# EAGLE design Battery Discharge Monitoring Board rev2 (EAGLE 9.3.0)
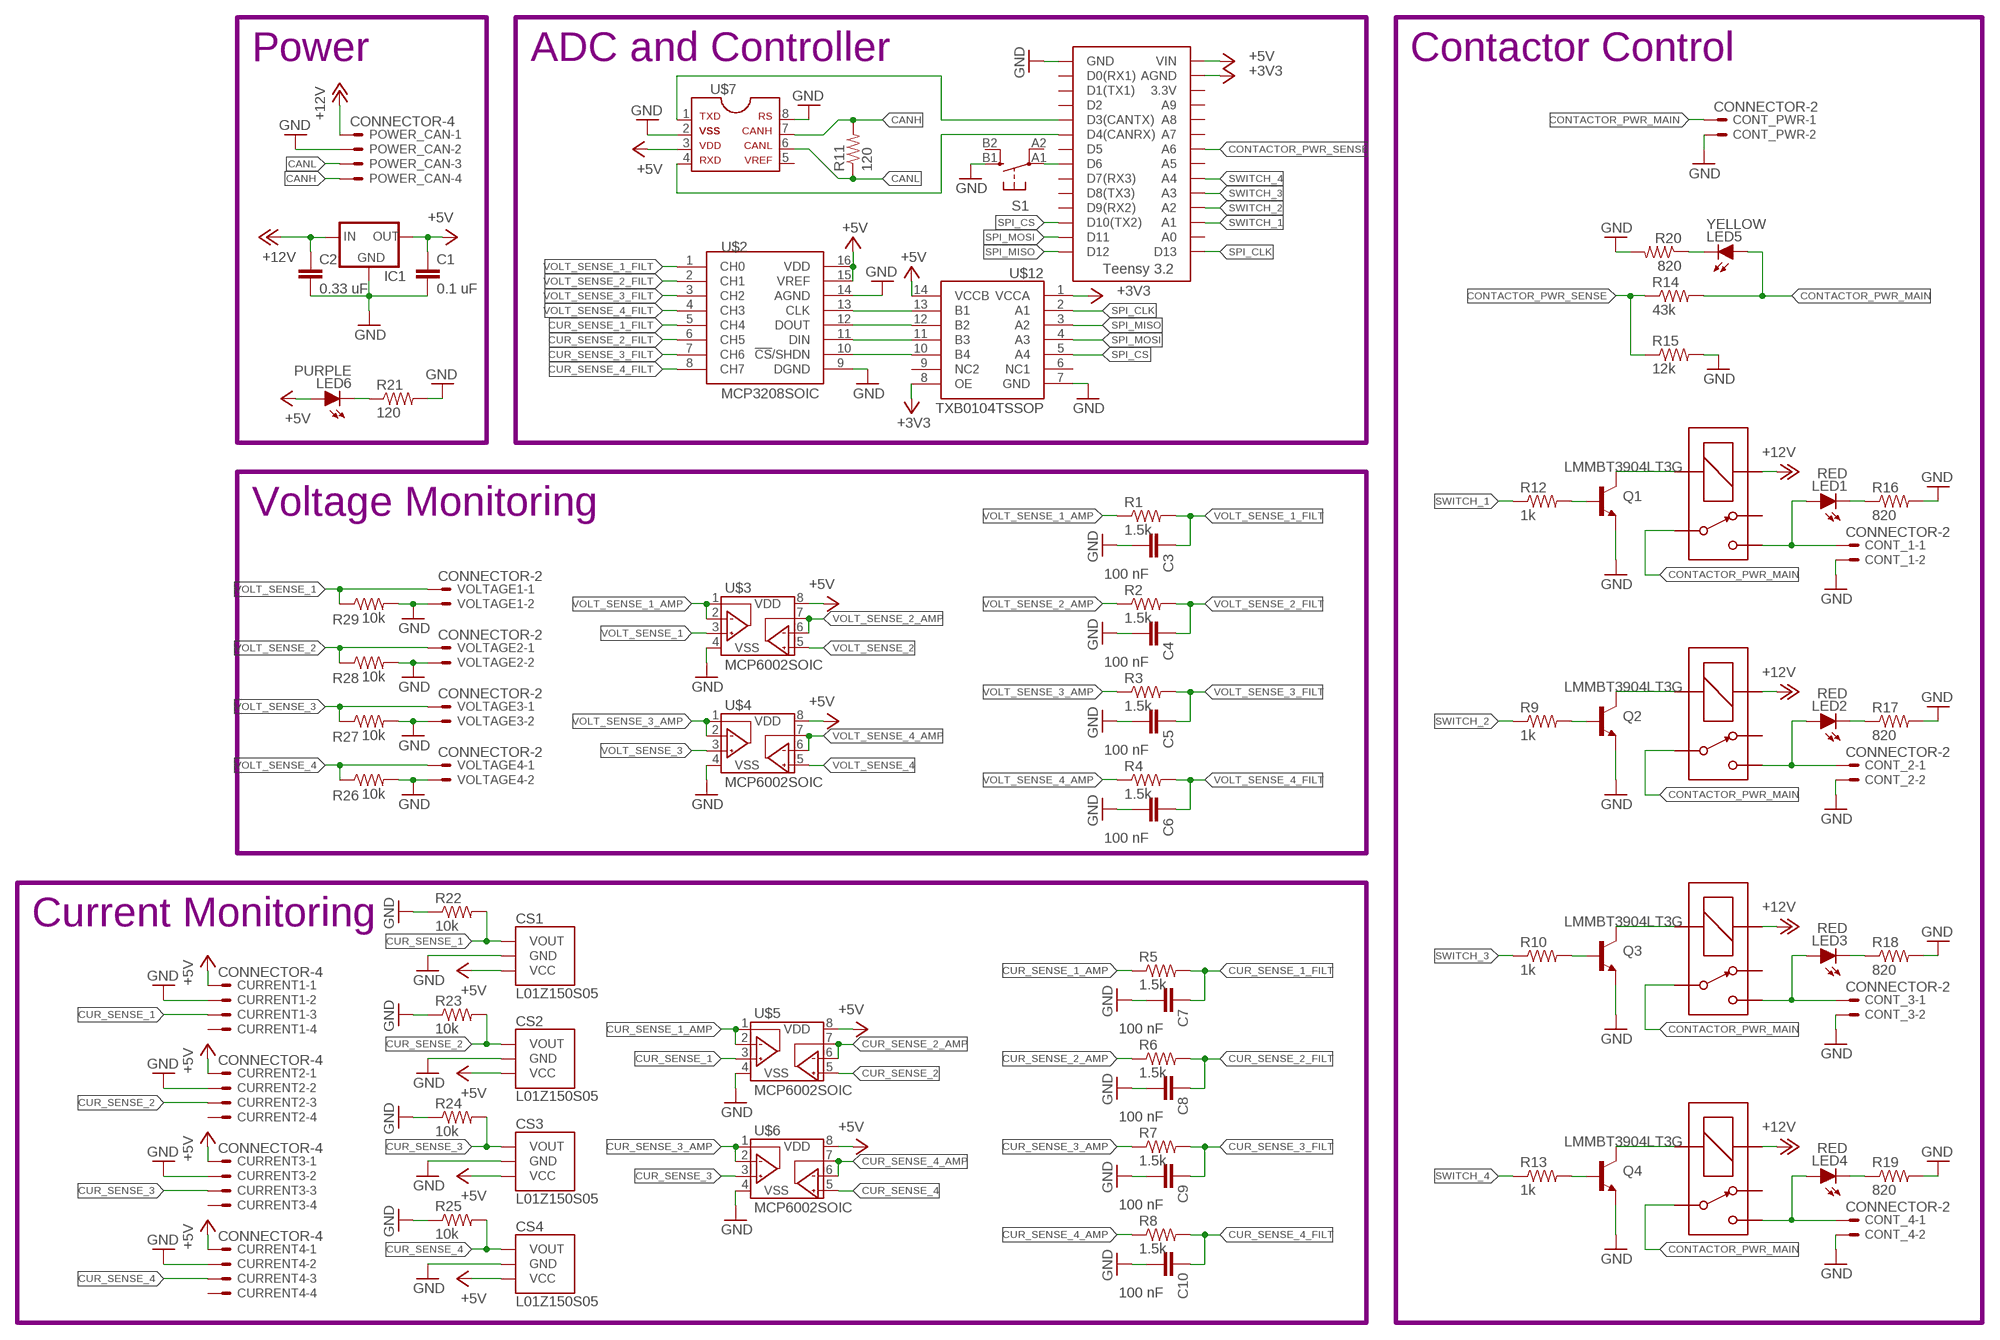
[diagram p0: schematic, sheet 1]

## Parts
C1  0.1 uF  CAP0805  [0805]
C2  0.33 uF  CAP0805  [0805]
C3  100 nF  CAP0805  [0805]
C4  100 nF  CAP0805  [0805]
C5  100 nF  CAP0805  [0805]
C6  100 nF  CAP0805  [0805]
C7  100 nF  CAP0805  [0805]
C8  100 nF  CAP0805  [0805]
C9  100 nF  CAP0805  [0805]
C10  100 nF  CAP0805  [0805]
CONT_1  CONNECTOR-2  [MINIFIT_5566-2]
CONT_2  CONNECTOR-2  [MINIFIT_5566-2]
CONT_3  CONNECTOR-2  [MINIFIT_5566-2]
CONT_4  CONNECTOR-2  [MINIFIT_5566-2]
CONT_PWR  CONNECTOR-2  [MINIFIT_5566-2]
CS1  L01Z150S05  [L01Z150S05]
CS2  L01Z150S05  [L01Z150S05]
CS3  L01Z150S05  [L01Z150S05]
CS4  L01Z150S05  [L01Z150S05]
CURRENT1  CONNECTOR-4  [MINIFIT_5566-4]
CURRENT2  CONNECTOR-4  [MINIFIT_5566-4]
CURRENT3  CONNECTOR-4  [MINIFIT_5566-4]
CURRENT4  CONNECTOR-4  [MINIFIT_5566-4]
IC1  5VREG_L7805SPACED  [TO-220-SPACED]
LED1  RED  LED-0805  [LED-805]
LED2  RED  LED-0805  [LED-805]
LED3  RED  LED-0805  [LED-805]
LED4  RED  LED-0805  [LED-805]
LED5  YELLOW  LED-0805  [LED-805]
LED6  PURPLE  LED-0805  [LED-805]
POWER_CAN  CONNECTOR-4  [MINIFIT_5566-4]
Q1  LMMBT3904LT3G  BJT_NPNSOT  [SOT23]
Q2  LMMBT3904LT3G  BJT_NPNSOT  [SOT23]
Q3  LMMBT3904LT3G  BJT_NPNSOT  [SOT23]
Q4  LMMBT3904LT3G  BJT_NPNSOT  [SOT23]
R1  1.5k  RESISTOR0805-RES  [0805]
R2  1.5k  RESISTOR0805-RES  [0805]
R3  1.5k  RESISTOR0805-RES  [0805]
R4  1.5k  RESISTOR0805-RES  [0805]
R5  1.5k  RESISTOR0805-RES  [0805]
R6  1.5k  RESISTOR0805-RES  [0805]
R7  1.5k  RESISTOR0805-RES  [0805]
R8  1.5k  RESISTOR0805-RES  [0805]
R9  1k  RESISTOR0805-RES  [0805]
R10  1k  RESISTOR0805-RES  [0805]
R11  120  RESISTOR0805-RES  [0805]
R12  1k  RESISTOR0805-RES  [0805]
R13  1k  RESISTOR0805-RES  [0805]
R14  43k  RESISTOR0805-RES  [0805]
R15  12k  RESISTOR0805-RES  [0805]
R16  820  RESISTOR0805-RES  [0805]
R17  820  RESISTOR0805-RES  [0805]
R18  820  RESISTOR0805-RES  [0805]
R19  820  RESISTOR0805-RES  [0805]
R20  820  RESISTOR0805-RES  [0805]
R21  120  RESISTOR0805-RES  [0805]
R22  10k  RESISTOR0805-RES  [0805]
R23  10k  RESISTOR0805-RES  [0805]
R24  10k  RESISTOR0805-RES  [0805]
R25  10k  RESISTOR0805-RES  [0805]
R26  10k  RESISTOR0805-RES  [0805]
R27  10k  RESISTOR0805-RES  [0805]
R28  10k  RESISTOR0805-RES  [0805]
R29  10k  RESISTOR0805-RES  [0805]
S1  BTN_10-XXSMD  [TACTILE_SWITCH_SMD_6.2MM_TALL]
U$1  TEENSY_3.2_SIMPLE  [TEENSY_3.2_SIMPLE]
U$2  MCP3208SOIC  [SOIC-16]
U$3  MCP6002SOIC  [SOIC-08]
U$4  MCP6002SOIC  [SOIC-08]
U$5  MCP6002SOIC  [SOIC-08]
U$6  MCP6002SOIC  [SOIC-08]
U$7  MCP2551  [SOIC-08]
U$8  G5LE  [ZF112]
U$9  G5LE  [ZF112]
U$10  G5LE  [ZF112]
U$11  G5LE  [ZF112]
U$12  TXB0104TSSOP  [TSSOP-14]
VOLTAGE1  CONNECTOR-2  [MINIFIT_5566-2]
VOLTAGE2  CONNECTOR-2  [MINIFIT_5566-2]
VOLTAGE3  CONNECTOR-2  [MINIFIT_5566-2]
VOLTAGE4  CONNECTOR-2  [MINIFIT_5566-2]

## Nets
+3V3: U$1.AGND U$12.1(VCCA) U$12.8(OE)
+5V: C1.1 CS1.3(VCC) CS2.3(VCC) CS3.3(VCC) CS4.3(VCC) CURRENT1.1 CURRENT2.1 CURRENT3.1 CURRENT4.1 IC1.3(OUT) LED6.A U$1.VIN U$2.15(VREF) U$2.16(VDD) U$3.8(VDD) U$4.8(VDD) U$5.8(VDD) U$6.8(VDD) U$7.3 U$12.14(VCCB)
+12V: C2.1 IC1.1(IN) POWER_CAN.1 U$8.1(COIL+) U$9.1(COIL+) U$10.1(COIL+) U$11.1(COIL+)
CANH: POWER_CAN.4 R11.2 U$7.7
CANL: POWER_CAN.3 R11.1 U$7.6
CONTACTOR_PWR_1: CONT_1.1 LED1.A U$8.S
CONTACTOR_PWR_2: CONT_2.1 LED2.A U$9.S
CONTACTOR_PWR_3: CONT_3.1 LED3.A U$10.S
CONTACTOR_PWR_4: CONT_4.1 LED4.A U$11.S
CONTACTOR_PWR_MAIN: CONT_PWR.1 LED5.A R14.2 U$8.P U$9.P U$10.P U$11.P
CONTACTOR_PWR_SENSE: R14.1 R15.1 U$1.A6
CUR_SENSE_1: CS1.1(VOUT) CURRENT1.3 R22.2 U$5.3(VINA+)
CUR_SENSE_1_AMP: R5.1 U$5.1(VOUTA) U$5.2(VINA-)
CUR_SENSE_1_FILT: C7.1 R5.2 U$2.5(CH4)
CUR_SENSE_2: CS2.1(VOUT) CURRENT2.3 R23.2 U$5.5(VINB+)
CUR_SENSE_2_AMP: R6.1 U$5.6(VINB-) U$5.7(VOUTB)
CUR_SENSE_2_FILT: C8.1 R6.2 U$2.6(CH5)
CUR_SENSE_3: CS3.1(VOUT) CURRENT3.3 R24.2 U$6.3(VINA+)
CUR_SENSE_3_AMP: R7.1 U$6.1(VOUTA) U$6.2(VINA-)
CUR_SENSE_3_FILT: C9.1 R7.2 U$2.7(CH6)
CUR_SENSE_4: CS4.1(VOUT) CURRENT4.3 R25.2 U$6.5(VINB+)
CUR_SENSE_4_AMP: R8.1 U$6.6(VINB-) U$6.7(VOUTB)
CUR_SENSE_4_FILT: C10.1 R8.2 U$2.8(CH7)
GND: C1.2 C2.2 C3.2 C4.2 C5.2 C6.2 C7.2 C8.2 C9.2 C10.2 CONT_1.2 CONT_2.2 CONT_3.2 CONT_4.2 CONT_PWR.2 CS1.2(GND) CS2.2(GND) CS3.2(GND) CS4.2(GND) CURRENT1.2 CURRENT2.2 CURRENT3.2 CURRENT4.2 IC1.2(GND) POWER_CAN.2 Q1.2(EMITTER) Q2.2(EMITTER) Q3.2(EMITTER) Q4.2(EMITTER) R15.2 R16.2 R17.2 R18.2 R19.2 R20.2 R21.2 R22.1 R23.1 R24.1 R25.1 R26.2 R27.2 R28.2 R29.2 S1.B1(S) U$1.GND U$2.9(DGND) U$2.14(AGND) U$3.4(VSS) U$4.4(VSS) U$5.4(VSS) U$6.4(VSS) U$7.2 U$7.8 U$12.7(GND) VOLTAGE1.2 VOLTAGE2.2 VOLTAGE3.2 VOLTAGE4.2
N$1: U$1.D3(CANTX) U$7.1
N$2: U$1.D4(CANRX) U$7.4
N$3: Q2.1(BASE) R9.2
N$4: Q1.1(BASE) R12.2
N$5: Q1.3(COLLECTOR) U$8.2(COIL-)
N$6: Q2.3(COLLECTOR) U$9.2(COIL-)
N$7: Q3.1(BASE) R10.2
N$8: Q3.3(COLLECTOR) U$10.2(COIL-)
N$9: Q4.1(BASE) R13.2
N$10: Q4.3(COLLECTOR) U$11.2(COIL-)
N$11: LED2.C R17.1
N$12: LED1.C R16.1
N$13: LED3.C R18.1
N$14: LED4.C R19.1
N$15: LED5.C R20.1
N$16: LED6.C R21.1
N$17: U$2.13(CLK) U$12.13(B1)
N$18: U$2.12(DOUT) U$12.12(B2)
N$19: U$2.11(DIN) U$12.11(B3)
N$20: U$2.10(!CS!/SHDN) U$12.10(B4)
N$21: S1.A1(P) U$1.D6
SPI_CLK: U$1.D13 U$12.2(A1)
SPI_CS: U$1.D10(TX2) U$12.5(A4)
SPI_MISO: U$1.D12 U$12.3(A2)
SPI_MOSI: U$1.D11 U$12.4(A3)
SWITCH_1: R12.1 U$1.A1
SWITCH_2: R9.1 U$1.A2
SWITCH_3: R10.1 U$1.A3
SWITCH_4: R13.1 U$1.A4
VOLT_SENSE_1: R29.1 U$3.3(VINA+) VOLTAGE1.1
VOLT_SENSE_1_AMP: R1.1 U$3.1(VOUTA) U$3.2(VINA-)
VOLT_SENSE_1_FILT: C3.1 R1.2 U$2.1(CH0)
VOLT_SENSE_2: R28.1 U$3.5(VINB+) VOLTAGE2.1
VOLT_SENSE_2_AMP: R2.1 U$3.6(VINB-) U$3.7(VOUTB)
VOLT_SENSE_2_FILT: C4.1 R2.2 U$2.2(CH1)
VOLT_SENSE_3: R27.1 U$4.3(VINA+) VOLTAGE3.1
VOLT_SENSE_3_AMP: R3.1 U$4.1(VOUTA) U$4.2(VINA-)
VOLT_SENSE_3_FILT: C5.1 R3.2 U$2.3(CH2)
VOLT_SENSE_4: R26.1 U$4.5(VINB+) VOLTAGE4.1
VOLT_SENSE_4_AMP: R4.1 U$4.6(VINB-) U$4.7(VOUTB)
VOLT_SENSE_4_FILT: C6.1 R4.2 U$2.4(CH3)
Unconnected: CURRENT1.4 CURRENT2.4 CURRENT3.4 CURRENT4.4 S1.A2(P1) S1.B2(S1) U$1.3.3V U$1.A0 U$1.A5 U$1.A7 U$1.A8 U$1.A9 U$1.D0(RX1) U$1.D1(TX1) U$1.D2 U$1.D5 U$1.D7(RX3) U$1.D8(TX3) U$1.D9(RX2) U$7.5 U$8.O U$9.O U$10.O U$11.O U$12.6(NC1) U$12.9(NC2)

## Notes on the sheet
- Power | ADC and Controller | Contactor Control
- Voltage Monitoring
- Current Monitoring

## Library data of the parts
C1-C10 = HyTechDevices:CAP: Capacitor Standard 0603 ceramic capacitor, and 0.1" leaded capacitor.
CONT_1-CONT_4 CONT_PWR VOLTAGE1-VOLTAGE4 = HyTechDevices:CONNECTOR-2: Mini-Fit Junior connector 2 pole Source: http://www.molex.com; OC_FARNELL: 1822072; OC_NEWARK: unknown
CS1-CS4 = HyTechDevices:L01Z150S05: Tamura Hall Effect Current Sensors L01Z***S05 Series Refer to datasheet <http://www.tamuracorp.com/clientuploads/pdfs/engineeringdocs/L01ZXXXS05.pdf>
CURRENT1-CURRENT4 POWER_CAN = HyTechDevices:CONNECTOR-4: Mini-Fit Junior connector 4 pole Source: http://www.molex.com; OC_FARNELL: unknown; OC_NEWARK: unknown
IC1 = HyTechDevices:5VREG_L7805: Voltage Regulator Switching 5v regulator Datasheet <http://power.murata.com/data/power/oki-78sr.pdf> Standard 7805 5V regulator. IGO (Input Ground Output). Spark Fun Electronics SKU : COM-00107 Datasheet <http://www.mouser.com/ds/2/308/MC7800-D-94905.pdf>
LED1-LED6 = HyTechDevices:LED: Light Emitting Diode (LED) Source: Dangerous Prototypes Eagle Library <https://github.com/DangerousPrototypes/Eagle_Part_Library>
Q1-Q4 = HyTechDevices:BJT_NPN: Generic NPN BJT MMBT2222A - TRANS-08049 (SOT-23, 1A 40V) MPSA42 - TRANS-09116 (SOT-23, 500mA 300V) MMBT5088LT1G - TRANS-11160 (SOT-23, 50 mA 30V) BC547 - COM-08928 <http://www.sparkfun.com/products/8928> (TO-92 45V 100mA) (1.Collector 2.Base 3.Emitter) 2N3904 - COM-00521 <http://www.sparkfun.com/products/521> (TO-92 40V 200mA) (1.Emitter 2.Base 3.Collector) P2N2222A - COM-12852 <http://www.sparkfun.com/products/12852> (TO-92 40V 600mA) (1.Collector 2.Base 3.Emitter) Source: Sparkfun <https://github.com/sparkfun/SparkFun-Eagle-Libraries>
R1-R29 = HyTechDevices:RESISTOR: Resistor Basic schematic elements and footprints for 0603, 1206, and PTH resistors.
S1 = HyTechDevices:BTN_10-XX: Small momentary tactile push button
U$1 = HyTechDevices:TEENSY_3.2_SIMPLE: Simple version of the Teensy 3.2 board that only uses the 2 main rows of pins, not the inner pins or the pins opposite the usb port.
U$2 = HyTechDevices:MCP3208: Analog to Digital Converter
U$3-U$6 = HyTechDevices:MCP6002: Microchip MCP6002 Dual Channel Op Amp
U$7 = HyTechDevices:MCP2551: MCP2551 High-Speed CAN Transceiver Product Webpage <https://www.microchip.com/wwwproducts/en/MCP2551> Datasheet <http://ww1.microchip.com/downloads/en/DeviceDoc/21667f.pdf> This device is outdated It is replaced by MCP2561. Comparison Page <https://www.microchip.com/wwwproducts/ProductCompare/MCP2551/MCP2561> Product Webpage <https://www.microchip.com/wwwproducts/en/MCP2561> Datasheet <http://ww1.microchip.com/downloads/en/DeviceDoc/20005167C.pdf>
U$8-U$11 = HyTechDevices:G5LE: Omron G5LE SPST Relay 5 VDC, 12VDC, 24VDC models Coil voltage: 75% - 170% of nominal voltage Datasheet <https://www.omron.com/ecb/products/pdf/en-g5le.pdf>
U$12 = HyTechDevices:TXB0104: Texas Instruments TXB0104 4-channel low voltage to high voltage Logic Level Shifter. Minimum input voltage level 1.8V. Maximum output voltage level 5.5V.

## Board
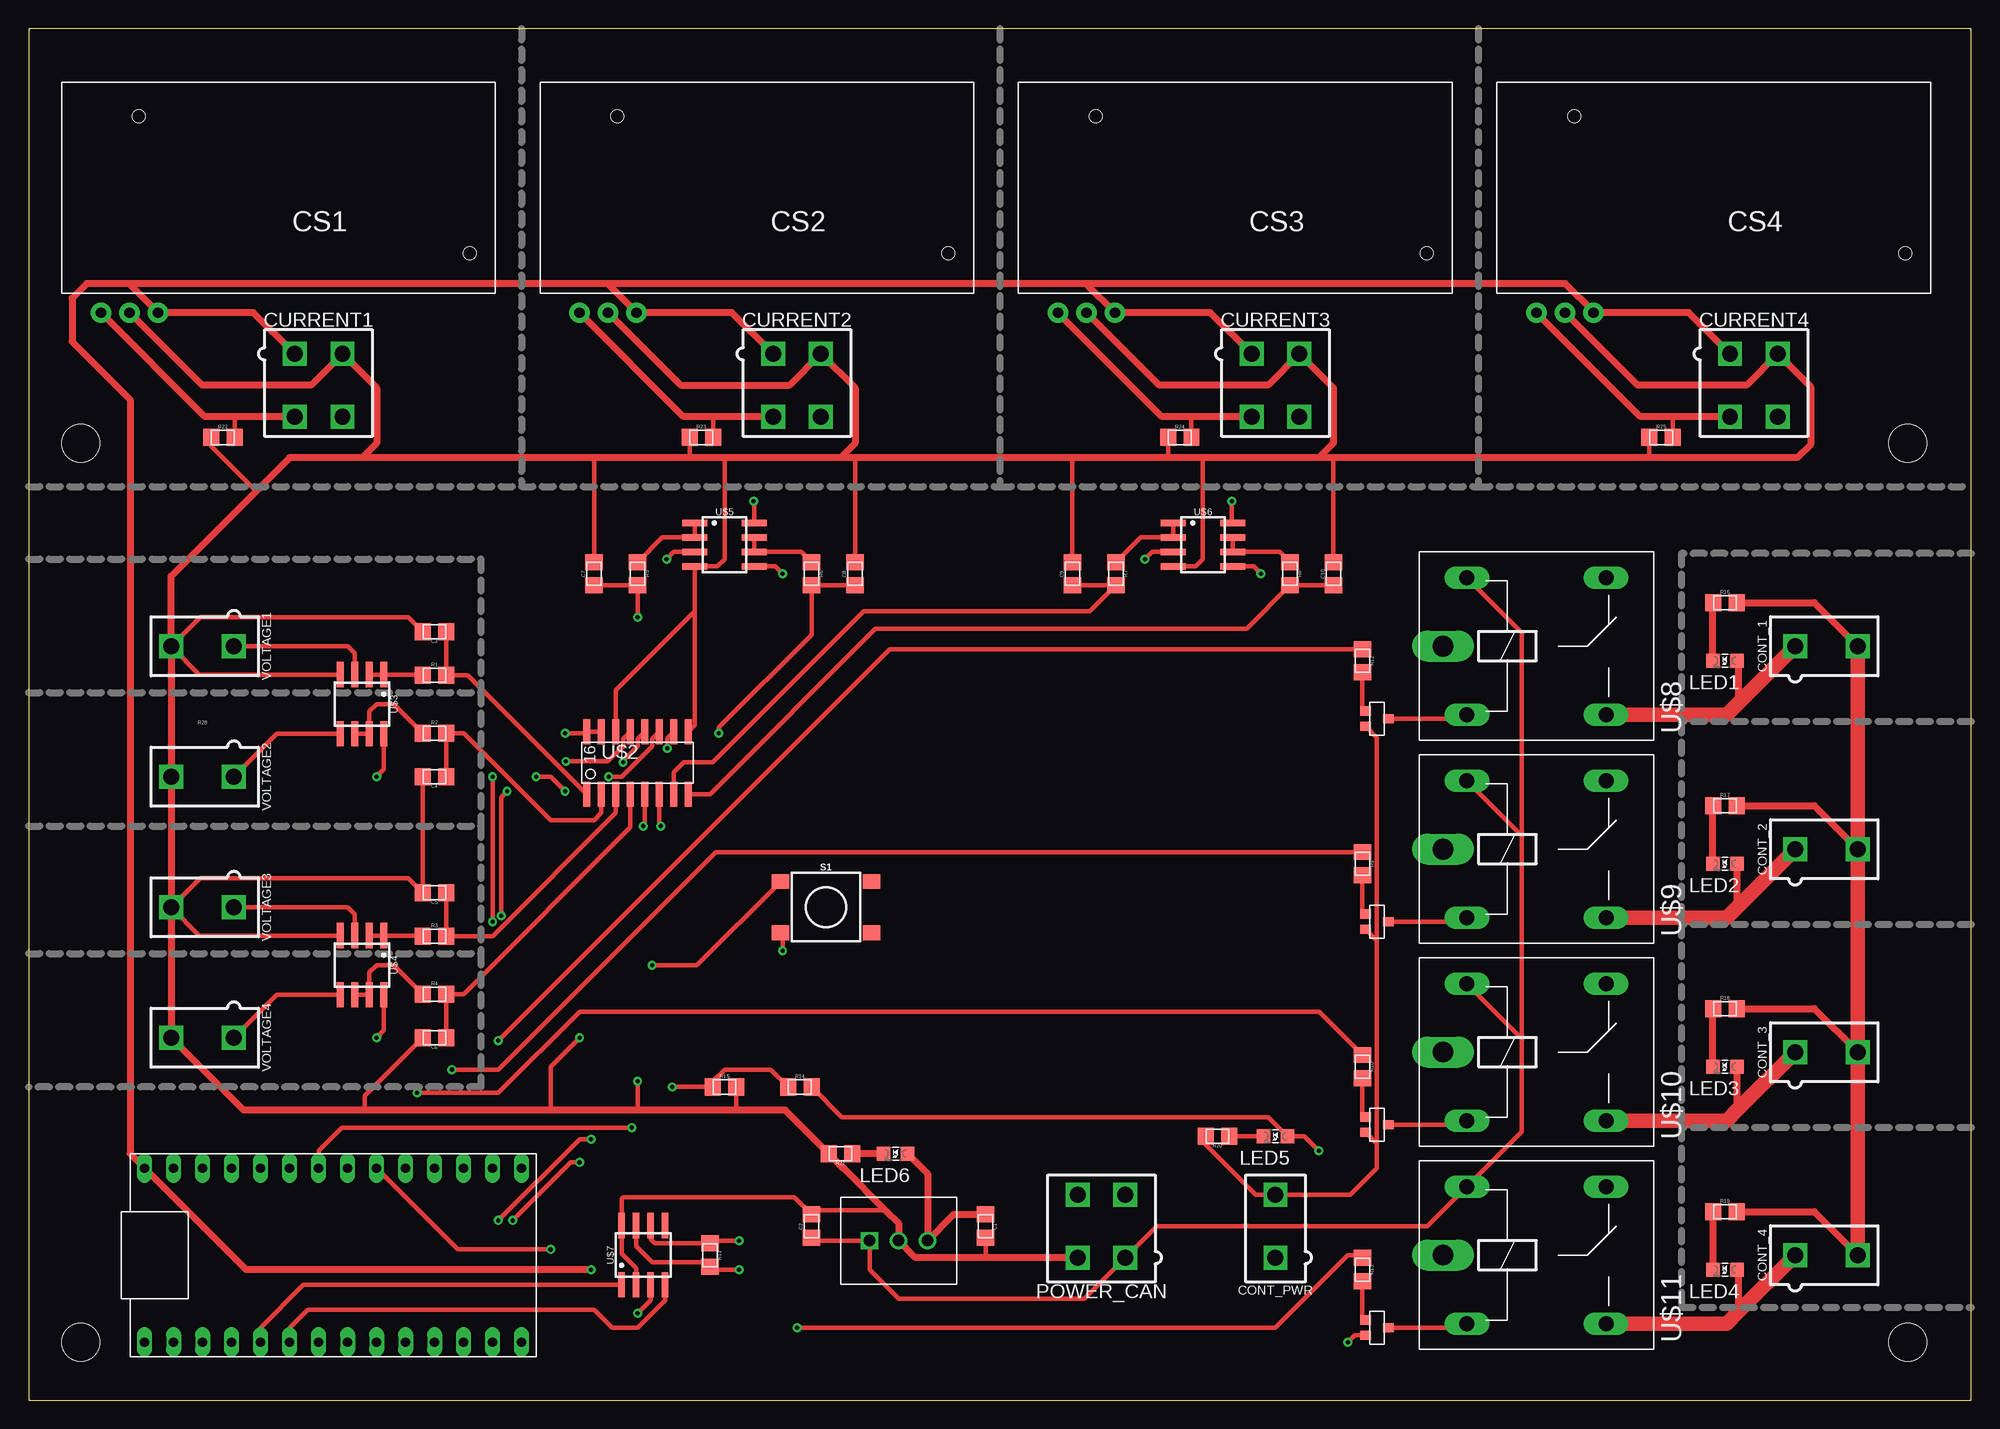
[diagram p1: board, top side]
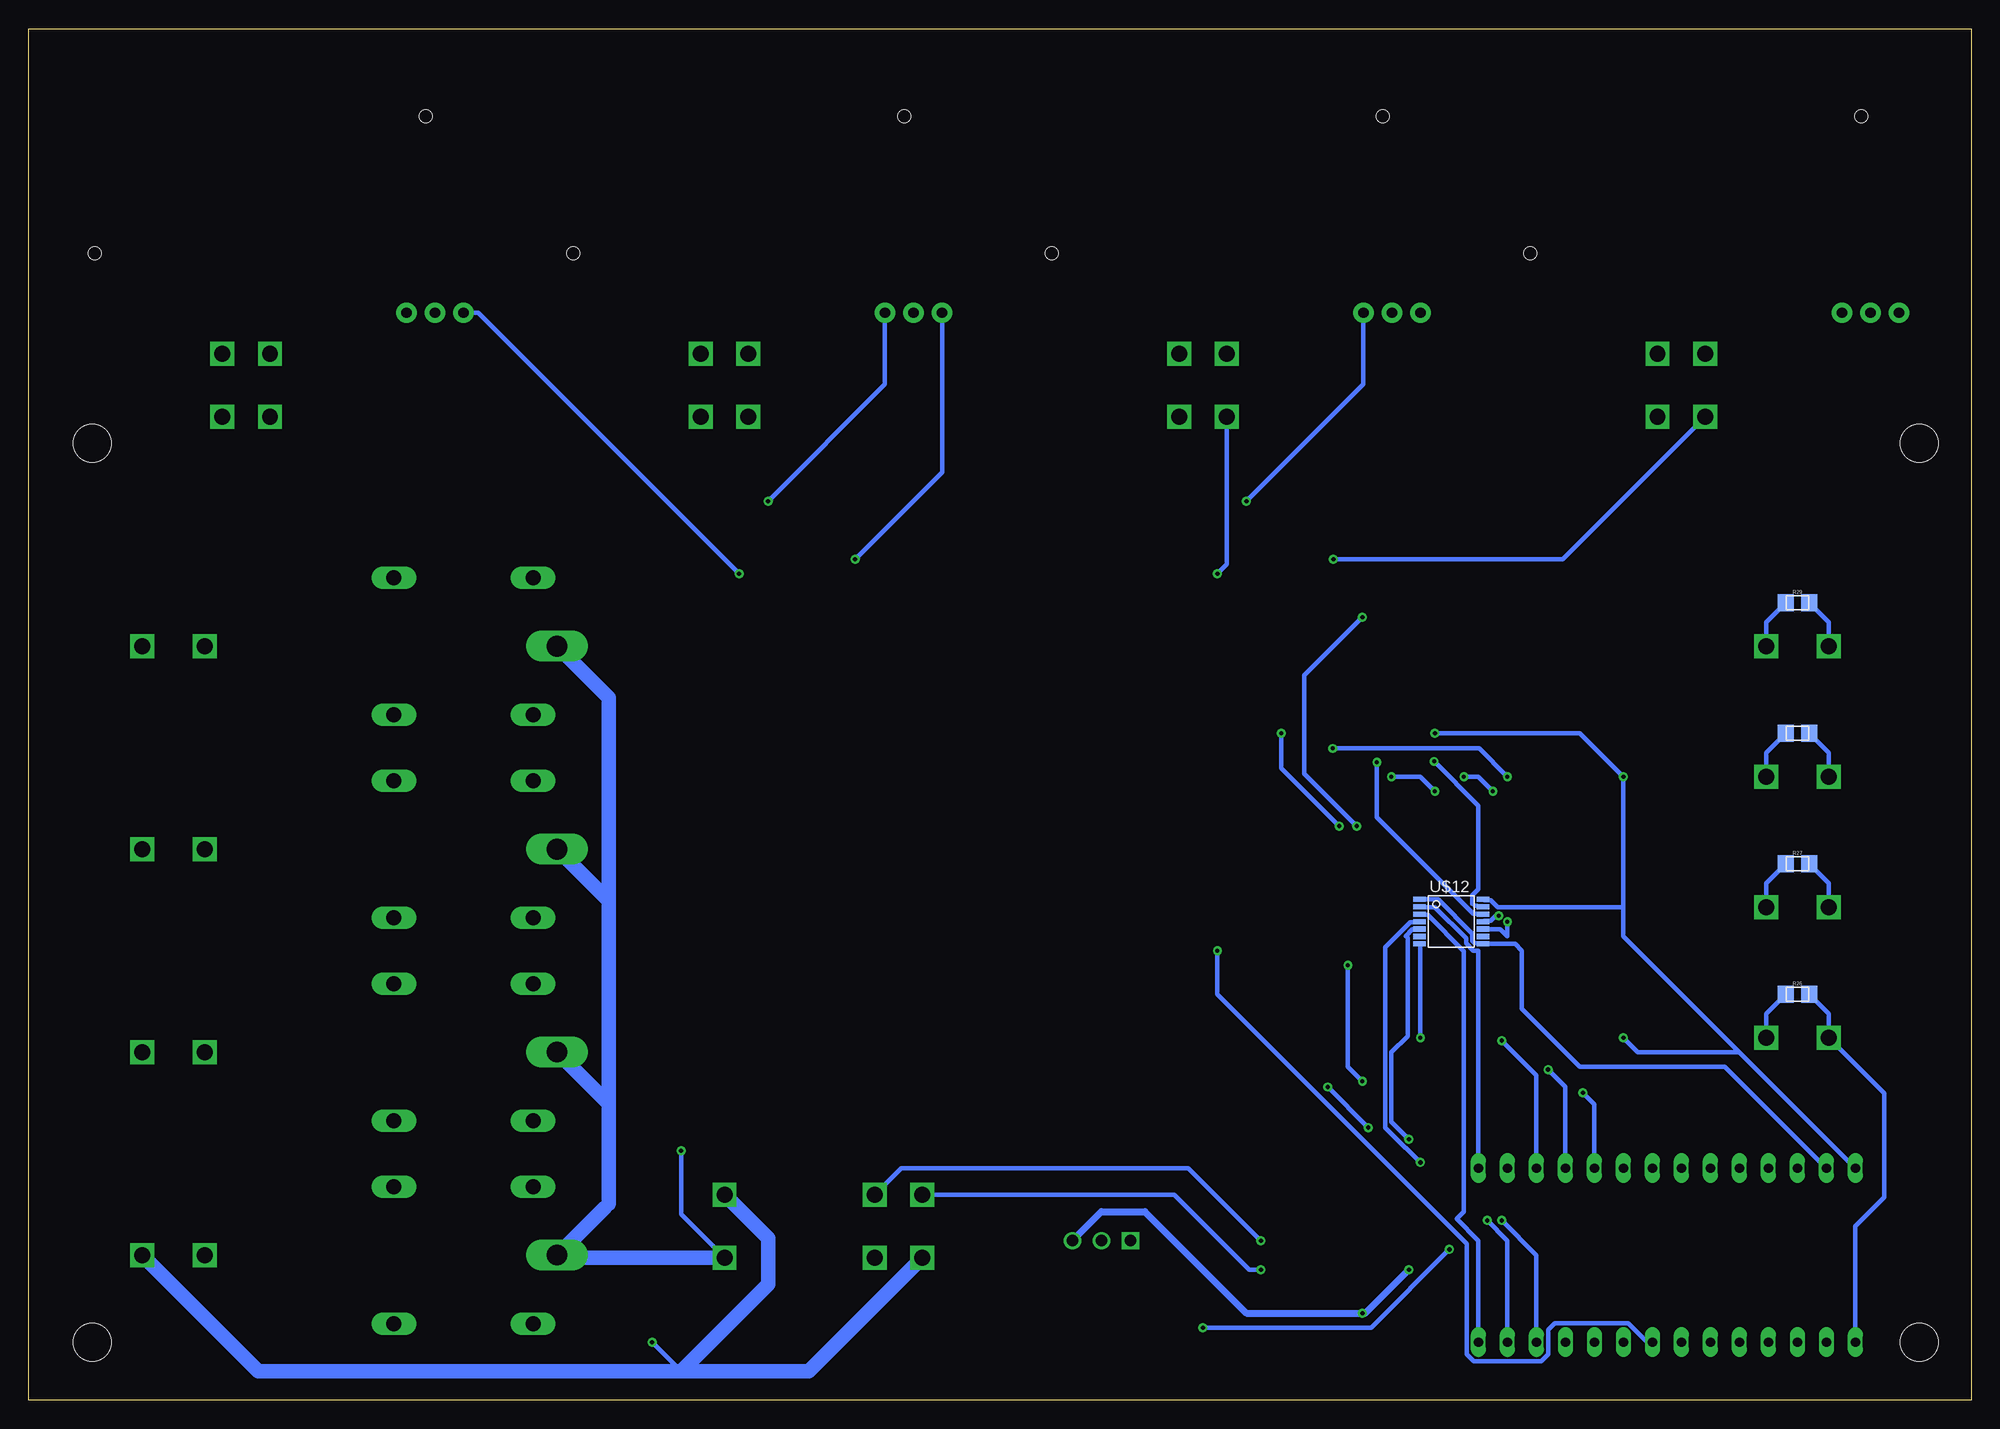
[diagram p2: board, bottom side, seen from below]

Size 170.18 x 120.14 mm. Coordinates in mm from the lower left corner, seen from the top.
Outline: 0,0 170.18,0 170.18,120.14 0,120.14 0,0
Copper layers (1*16): Top 0.035mm / dielectric 1.5mm / Bottom 0.035mm
Design rules "default": minimum track width 6mil, minimum drill 0.35mm, track to track 6mil, track to pad 6mil, pad to pad 6mil, via to via 6mil, smd to smd 6mil, copper to edge 40mil, drill to drill 6mil, minimum pad ring 10mil, minimum via ring 8mil, stop-mask expansion 4mil, vias tented up to drill 0mil, thermal gap 10mil
Holes 3.3 mm at 4.57,5.08 164.59,5.08 4.57,83.82 164.59,83.82

### Footprints (pad centres in the part's own frame; a part is rotated, then mirrored left to right if it is on the bottom)
0805 = smd 1.4 x 1.5: 1 -1.025,0; 2 1.025,0
MINIFIT_5566-2 = drill 1.4 square: 1 0,-2.75; 2 0,2.75
L01Z150S05 = drill 0.9 pad 1.778: 1 0,0; 2 -2.5,0; 3 -5,0 | hole 1.15: -3.3,-17.2; -32.3,-5.2
MINIFIT_5566-4 = drill 1.4 square: 1 2.1,-2.75; 2 -2.1,-2.75; 3 2.1,2.75; 4 -2.1,2.75
TO-220-SPACED = drill 1 square: 1 -2.54,0 | drill 1: 2 0,0; 3 2.54,0
LED-805 = smd 1.2 x 1.2: A 0,-1.05; C 0,1.05
SOT23 = smd 0.8 x 0.9: 1 -0.675,-1; 2 0.675,-1; 3 0,1
TACTILE_SWITCH_SMD_6.2MM_TALL = smd 1.55 x 1.3: A1 -3.975,-2.25; A2 3.975,-2.25; B1 -3.975,2.25; B2 3.975,2.25
TEENSY_3.2_SIMPLE = drill 0.8 long: 3.3V 16.51,29.21; A0 16.51,3.81; A1 16.51,6.35; A2 16.51,8.89; A3 16.51,11.43; A4 16.51,13.97; A5 16.51,16.51; A6 16.51,19.05; A7 16.51,21.59; A8 16.51,24.13; A9 16.51,26.67; AGND 16.51,31.75; D0(RX1) 1.27,31.75; D1(TX1) 1.27,29.21; D2 1.27,26.67; D3(CANTX) 1.27,24.13; D4(CANRX) 1.27,21.59; D5 1.27,19.05; D6 1.27,16.51; D7(RX3) 1.27,13.97; D8(TX3) 1.27,11.43; D9(RX2) 1.27,8.89; D10(TX2) 1.27,6.35; D11 1.27,3.81; D12 1.27,1.27; D13 16.51,1.27; GND 1.27,34.29; VIN 16.51,34.29
SOIC-16 = smd 0.6 x 2.2: 1 -4.445,-2.794; 2 -3.175,-2.794; 3 -1.905,-2.794; 4 -0.635,-2.794; 5 0.635,-2.794; 6 1.905,-2.794; 7 3.175,-2.794; 8 4.445,-2.794; 9 4.445,2.667; 10 3.175,2.667; 11 1.905,2.667; 12 0.635,2.667; 13 -0.635,2.667; 14 -1.905,2.667; 15 -3.175,2.667; 16 -4.445,2.667
SOIC-08 = smd 0.6 x 2.2: 1 -1.905,-2.6; 2 -0.635,-2.6; 3 0.635,-2.6; 4 1.905,-2.6; 5 1.905,2.6; 6 0.635,2.6; 7 -0.635,2.6; 8 -1.905,2.6
ZF112 = drill 1.321 long: 1 4.064,14.884; 2 4.064,2.896; O 16.256,14.884; S 16.256,2.896 | drill 1.803 long: P 1.956,8.89
TSSOP-14 = smd 0.45 x 1.1: 1 -1.958,-2.618; 2 -1.308,-2.618; 3 -0.657,-2.618; 4 -0.007,-2.618; 5 0.642,-2.618; 6 1.292,-2.618; 7 1.942,-2.618; 8 1.942,2.918; 9 1.292,2.918; 10 0.642,2.918; 11 -0.007,2.918; 12 -0.657,2.918; 13 -1.308,2.918; 14 -1.958,2.918

### Placement (x,y rotation side)
C1  83.82,15.24 270 top
C2  68.58,15.24 90 top
C3  35.56,67.31 180 top
C4  35.56,54.61 180 top
C5  35.56,44.45 180 top
C6  35.56,31.75 180 top
C7  49.53,72.39 90 top
C8  72.39,72.39 90 top
C9  91.44,72.39 90 top
C10  114.3,72.39 90 top
CONT_1  157.48,66.04 270 top
CONT_2  157.48,48.26 270 top
CONT_3  157.48,30.48 270 top
CONT_4  157.48,12.7 270 top
CONT_PWR  109.22,15.24 0 top
CS1  6.35,95.25 180 top
CS2  48.26,95.25 180 top
CS3  90.17,95.25 180 top
CS4  132.08,95.25 180 top
CURRENT1  25.4,88.9 180 top
CURRENT2  67.31,88.9 180 top
CURRENT3  109.22,88.9 180 top
CURRENT4  151.13,88.9 180 top
IC1  76.2,13.97 0 top
LED1  148.59,64.77 90 top
LED2  148.59,46.99 90 top
LED3  148.59,29.21 90 top
LED4  148.59,11.43 90 top
LED5  109.22,23.11 90 top
LED6  75.95,21.59 90 top
POWER_CAN  93.98,15.24 0 top
Q1  118.11,59.69 270 top
Q2  118.11,41.91 270 top
Q3  118.11,24.13 270 top
Q4  118.11,6.35 270 top
R1  35.56,63.5 0 top
R2  35.56,58.42 0 top
R3  35.56,40.64 0 top
R4  35.56,35.56 0 top
R5  53.34,72.39 270 top
R6  68.58,72.39 270 top
R7  95.25,72.39 270 top
R8  110.49,72.39 270 top
R9  116.84,46.99 270 top
R10  116.84,29.21 270 top
R11  59.69,12.7 270 top
R12  116.84,64.77 270 top
R13  116.84,11.43 270 top
R14  67.56,27.43 0 top
R15  60.96,27.43 0 top
R16  148.59,69.85 0 top
R17  148.59,52.07 0 top
R18  148.59,34.29 0 top
R19  148.59,16.51 0 top
R20  104.14,23.11 180 top
R21  71.12,21.59 180 top
R22  17.02,84.33 0 top
R23  58.93,84.33 0 top
R24  100.84,84.33 0 top
R25  143,84.33 0 top
R26  15.24,35.56 0 bottom
R27  15.24,46.99 0 bottom
R28  15.24,58.42 0 bottom
R29  15.24,69.85 0 bottom
S1  69.85,43.18 0 top
U$1  44.45,3.81 90 top
U$2  53.34,55.88 0 top
U$3  29.21,60.96 180 top
U$4  29.21,38.1 180 top
U$5  60.96,74.93 270 top
U$6  102.87,74.93 270 top
U$7  53.85,12.7 0 top
U$8  121.92,57.15 0 top
U$9  121.92,39.37 0 top
U$10  121.92,21.59 0 top
U$11  121.92,3.81 0 top
U$12  45.72,41.91 270 bottom
VOLTAGE1  15.24,66.04 90 top
VOLTAGE2  15.24,54.61 90 top
VOLTAGE3  15.24,43.18 90 top
VOLTAGE4  15.24,31.75 90 top

### Tracks (layer width: path | path; a pad name or v marks a point on that pad's centre or on a via)
+3V3
  Bottom 0.406: U$1.AGND 21.59,29.21 34.29,29.21 39.37,34.29 39.37,39.37 39.97,39.97 U$12.8 42.87,40.04 43.5,40.04 43.71,40.24 43.71,40.87 46.7,43.87 U$12.1
+5V  (via drill 0.38)
  Top 0.406: U$7.3 54.48,8.76 v53.34,7.62 | U$3.8 31.11,55.24 v30.48,54.61 | U$4.8 31.11,32.38 v30.48,31.75 | U$5.8 63.56,78.68 v63.5,78.74 | U$6.8 105.41,76.89 v105.41,78.74 | U$2.15 U$2.16 48.77,58.42 v46.99,58.42
  Top 0.61: CURRENT1.1 19.7,95.25 CS1.3 8.81,97.79 | CURRENT2.1 61.61,95.25 CS2.3 50.72,97.79 | CURRENT3.1 103.52,95.25 CS3.3 92.71,97.71 92.71,97.79 | CURRENT4.1 145.43,95.25 CS4.3 137.08,95.33 134.62,97.79 92.71,97.79 | 92.71,97.79 50.72,97.79 | 50.72,97.79 8.81,97.79 | 8.81,97.79 5.08,97.79 3.81,96.52 3.81,92.71 8.89,87.63 8.89,21.59 U$1.VIN 19.05,11.43 v49.28,11.43 | LED6.A 78.74,19.85 IC1.3 81.03,16.27 C1.1
  Bottom 0.406: U$1.VIN 20.32,30.48 | 20.32,30.48 30.48,40.64 30.48,43.18 | 30.48,43.18 v30.48,54.61 34.29,58.42 v46.99,58.42 | v30.48,31.75 29.21,30.48 20.32,30.48 | v63.5,78.74 53.26,88.98 CS2.3 | v105.41,78.74 95.17,88.98 CS3.3 | U$12.14 42.73,43.8 42.1,43.8 41.49,43.18 30.48,43.18
  Bottom 0.61: IC1.3 76.2,16.51 72.39,16.51 63.5,7.62 v53.34,7.62 53.09,7.62 v49.28,11.43
+12V
  Top 0.406: 130.81,49.43 130.81,67.21 U$8.1 | 130.81,49.43 130.81,31.65 | 130.81,31.65 130.81,23.52 U$11.1 122.53,15.24 98.83,15.24 POWER_CAN.1 92.48,8.89 76.2,8.89 73.66,11.43 IC1.1 68.83,13.97 C2.1 | U$10.1 130.81,31.65 | U$9.1 130.81,49.43
CANH  (via drill 0.38)
  Top 0.406: U$7.7 53.21,13.46 54.61,12.06 59.3,12.06 R11.2 59.94,11.43 v62.23,11.43
  Bottom 0.406: POWER_CAN.4 69.81,17.99 63.25,11.43 v62.23,11.43
CANL  (via drill 0.38)
  Top 0.406: U$7.6 54.48,14.1 54.85,13.72 R11.1 59.94,13.97 v62.23,13.97
  Bottom 0.406: POWER_CAN.3 93.75,20.32 68.58,20.32 v62.23,13.97
CONTACTOR_PWR_1
  Top 0.61: LED1.A 149.75,64.66 149.75,61.06
  Top 1.27: U$8.S 148.74,60.05 149.75,61.06 CONT_1.1
CONTACTOR_PWR_2
  Top 0.61: LED2.A 149.64,43.4 149.75,43.28
  Top 1.27: U$9.S 148.74,42.27 149.75,43.28 CONT_2.1
CONTACTOR_PWR_3
  Top 0.61: LED3.A 149.64,25.62 149.75,25.5
  Top 1.27: U$10.S 148.74,24.49 149.75,25.5 CONT_3.1
CONTACTOR_PWR_4
  Top 0.61: LED4.A 149.75,11.31 149.75,7.72
  Top 1.27: U$11.S 148.74,6.71 149.75,7.72 CONT_4.1
CONTACTOR_PWR_MAIN  (via drill 0.38)
  Top 0.406: v113.03,21.84 111.76,23.11 LED5.A 108.6,24.78 71.24,24.78 R14.2
  Bottom 0.406: v113.03,21.84 113.03,16.3 CONT_PWR.1
  Bottom 1.016: 119.72,16.85 119.38,17.2
  Bottom 1.27: CONT_PWR.1 123.67,12.49 U$11.P 119.72,16.85 | U$8.P 119.38,61.54 119.38,43.76 | 119.38,17.2 119.38,25.98 | 119.38,25.98 119.38,43.76 | U$9.P 119.38,43.76 | U$10.P 119.38,25.98
CONTACTOR_PWR_SENSE  (via drill 0.38)
  Top 0.406: U$1.A6 25.4,21.84 27.43,23.88 v52.83,23.88 | R14.1 65.02,28.96 60.96,28.96 59.94,27.93 R15.1 v56.39,27.43
  Bottom 0.406: v52.83,23.88 v56.39,27.43
CUR_SENSE_1  (via drill 0.38)
  Top 0.406: U$5.3 56.52,74.3 v55.88,73.66 | R22.2 18.04,85.91 18.29,86.15
  Top 0.61: CURRENT1.3 18.29,86.15 15.45,86.15 CS1.1
  Bottom 0.406: v55.88,73.66 35.79,73.66 CURRENT1.3
CUR_SENSE_1_AMP
  Top 0.406: U$5.1 U$5.2 55.49,75.56 R5.1
CUR_SENSE_1_FILT  (via drill 0.38)
  Top 0.406: C7.1 R5.2 v53.34,68.58 | v53.85,50.29 53.98,50.42 U$2.5
  Bottom 0.406: v53.34,68.58 58.42,63.5 58.42,54.86 v53.85,50.29
CUR_SENSE_2  (via drill 0.38)
  Top 0.406: v66.04,72.39 65.41,73.03 U$5.5 | R23.2 59.95,86.14 59.94,86.15
  Top 0.61: CURRENT2.3 59.94,86.15 57.36,86.15 CS2.1
  Bottom 0.406: CURRENT2.3 65.21,73.22 v66.04,72.39
CUR_SENSE_2_AMP
  Top 0.406: R6.1 67.7,74.3 U$5.6 U$5.7
CUR_SENSE_2_FILT  (via drill 0.38)
  Top 0.406: C8.1 R6.2 68.58,67.06 60.45,58.93 v60.45,58.42 | v55.37,50.29 55.24,50.42 U$2.6
  Bottom 0.406: v55.37,50.29 60.45,55.37 v60.45,58.42
CUR_SENSE_3  (via drill 0.38)
  Top 0.406: U$6.3 98.42,74.3 v97.79,73.66 | R24.2 101.86,85.89 101.6,86.15
  Top 0.61: CURRENT3.3 101.6,86.15 99.27,86.15 CS3.1
  Bottom 0.406: v97.79,73.66 90.17,81.28 CS3.1
CUR_SENSE_3_AMP
  Top 0.406: U$6.1 U$6.2 97.4,75.56 R7.1
CUR_SENSE_3_FILT
  Top 0.406: C9.1 R7.2 92.97,69.09 73.15,69.09 59.94,55.88 57.4,55.88 56.52,54.99 U$2.7
CUR_SENSE_4  (via drill 0.38)
  Top 0.406: U$6.5 107.31,73.03 v107.95,72.39 | R25.2 144.03,85.91 144.27,86.15
  Top 0.61: CURRENT4.3 144.27,86.15 141.18,86.15 CS4.1
  Bottom 0.406: v107.95,72.39 130.81,95.25 CS4.1
CUR_SENSE_4_AMP
  Top 0.406: U$6.7 U$6.6 109.61,74.3 R8.1
CUR_SENSE_4_FILT
  Top 0.406: C10.1 R8.2 106.69,67.56 74.17,67.56 59.69,53.09 U$2.8
GND  (via drill 0.35, 0.38)
  Top 0.406: Q1.2 118.11,58.02 118.11,40.23 | 118.11,22.45 118.11,20.32 115.78,17.99 CONT_PWR.2 107.49,17.99 103.11,22.36 R20.2 | 118.11,22.45 118.11,40.23 | Q4.2 116.17,5.67 v115.57,5.08 | C1.2 83.82,12.49 | U$7.2 53.21,11.56 51.94,12.83 U$7.8 51.94,17.65 52.07,17.78 67.06,17.78 C2.2 68.95,16.63 75.05,16.63 | U$3.4 14.97,63.56 VOLTAGE1.2 15.03,68.58 33.27,68.58 C3.2 | U$4.4 14.97,40.7 VOLTAGE3.2 12.6,43.28 15.03,45.72 33.27,45.72 C5.2 C4.2 | 60.96,82.55 60.96,73.66 60.33,73.03 U$5.4 58.36,69.09 | C7.2 49.53,82.55 | C8.2 72.39,82.55 | C9.2 91.44,82.55 | U$6.4 102.23,73.03 102.87,73.66 102.87,82.55 | C10.2 114.3,82.55 | 58.36,69.09 58.36,59.12 U$2.9 | U$2.14 51.44,62.16 58.36,69.09 | C6.2 29.46,26.68 29.46,25.4 | R15.2 61.98,25.41 61.98,25.4 | R22.1 15.99,83.58 19.94,79.63 | R23.1 57.9,82.56 57.91,82.55 | R25.1 141.98,82.81 142.24,82.55 | R24.1 99.81,82.81 100.08,82.55 | Q2.2 118.11,40.23 | Q3.2 118.11,22.45 | 45.72,25.4 45.72,29.21 v48.26,31.75 | S1.B1 58.55,38.1 v54.61,38.1 | v53.34,27.94 53.34,25.4
  Top 0.61: R16.2 156.42,69.85 160.12,66.14 | R17.2 156.42,52.07 CONT_2.2 | R18.2 156.42,34.29 160.12,30.59 | R19.2 156.42,16.51 CONT_4.2 | POWER_CAN.2 83.82,12.49 77.68,12.49 IC1.2 76.2,15.48 75.05,16.63 71.3,20.38 71.26,20.38 70.99,20.65 70.99,20.7 R21.2 66.28,25.4 61.98,25.4 53.34,25.4 45.72,25.4 29.46,25.4 18.84,25.4 VOLTAGE4.2 VOLTAGE3.2 | CS4.2 140.93,88.9 150.48,88.9 CURRENT4.2 156.09,88.78 156.09,83.7 154.94,82.55 142.24,82.55 114.3,82.55 113.03,82.55 | CS3.2 99.02,88.9 108.57,88.9 CURRENT3.2 114.3,88.67 114.3,83.82 113.03,82.55 | CS2.2 57.11,88.9 66.66,88.9 CURRENT2.2 72.39,88.67 72.39,83.82 71.12,82.55 | CS1.2 15.2,88.9 24.75,88.9 CURRENT1.2 30.48,88.67 30.48,83.82 29.21,82.55 | 12.6,43.28 12.49,43.39 VOLTAGE2.2 VOLTAGE1.2 12.49,72.18 19.94,79.63 22.86,82.55 29.21,82.55 | 113.03,82.55 102.87,82.55 100.08,82.55 91.44,82.55 72.39,82.55 71.12,82.55 | 71.12,82.55 60.96,82.55 57.91,82.55 49.53,82.55 29.21,82.55
  Top 1.016: CONT_3.2 160.12,30.59 | CONT_1.2 160.12,66.14
  Top 1.27: CONT_4.2 CONT_3.2 CONT_2.2 CONT_1.2
  Bottom 0.406: v115.57,5.08 113.03,2.54 | U$1.GND 10.16,15.24 7.62,17.78 7.62,26.88 VOLTAGE4.2 12.49,33.84 R26.2 | R27.2 12.49,45.27 VOLTAGE3.2 | R28.2 12.49,56.7 VOLTAGE2.2 | R29.2 12.49,68.12 VOLTAGE1.2 | v48.26,31.75 48.26,39.89 U$12.7 | v54.61,38.1 54.61,29.21 v53.34,27.94
  Bottom 1.27: CONT_PWR.2 105.41,14.18 105.41,10.16 113.03,2.54 | CONT_4.2 150.07,2.54 113.03,2.54 | POWER_CAN.2 101.83,2.54 113.03,2.54
N$1
  Top 0.406: U$1.D3(CANTX) 20.32,6.35 24.07,10.1 U$7.1
N$2
  Top 0.406: U$1.D4(CANRX) 22.86,6.35 24.45,7.94 49.53,7.94 51.12,6.35 53.34,6.35 55.75,8.76 U$7.4
N$3
  Top 0.406: Q2.1 116.84,42.85 R9.2
N$4
  Top 0.406: Q1.1 116.84,60.63 R12.2
N$5
  Top 0.406: U$8.2 125.63,59.69 Q1.3
N$6
  Top 0.406: U$9.2 125.63,41.91 Q2.3
N$7
  Top 0.406: Q3.1 116.84,25.07 R10.2
N$8
  Top 0.406: U$10.2 125.63,24.13 Q3.3
N$9
  Top 0.406: Q4.1 116.84,7.29 R13.2
N$10
  Top 0.406: U$11.2 125.63,6.35 Q4.3
N$11
  Top 0.61: LED2.C 147.54,52.05 R17.1
N$12
  Top 0.61: LED1.C 147.54,69.83 R16.1
N$13
  Top 0.61: LED3.C 147.54,34.27 R18.1
N$14
  Top 0.61: R19.1 147.54,16.48 LED4.C
N$15
  Top 0.406: LED5.C R20.1
N$16
  Top 0.61: LED6.C R21.1
N$17  (via drill 0.35)
  Top 0.406: U$2.13 52.09,57.93 52.09,57.3 50.74,55.95 v47.06,55.95
  Bottom 0.406: v47.06,55.95 43.18,52.07 43.18,44.77 43.71,44.24 43.71,43.49 43.5,43.29 43.29,43.29 43.18,43.18 42.84,43.18 U$12.13
N$18  (via drill 0.35)
  Top 0.406: U$2.12 53.36,57.93 53.36,57.3 52.07,56.01 v52.07,55.88
  Bottom 0.406: U$12.12 42.86,42.62 43.62,42.62 52.07,51.07 v52.07,55.88
N$19  (via drill 0.35)
  Top 0.406: v41.4,42.44 41.4,52.83 v41.91,53.34 | v44.45,54.61 45.72,54.61 v46.99,53.34 | U$2.11 54.63,57.93 54.63,57.3 51.94,54.61 v50.8,54.61
  Bottom 0.406: U$12.11 42.73,41.99 42.1,41.99 41.66,42.44 v41.4,42.44 | v41.91,53.34 43.18,54.61 v44.45,54.61 | v46.99,53.34 48.26,54.61 v50.8,54.61
N$20  (via drill 0.35)
  Top 0.406: v40.64,41.91 v40.64,54.61 | v55.94,57.09 55.94,57.97 U$2.10
  Bottom 0.406: 42.73,41.34 U$12.10 41.27,41.27 40.64,40.64 v40.64,41.91 | v40.64,54.61 43.12,57.09 v55.94,57.09
N$21  (via drill 0.35)
  Top 0.406: v66.04,39.37 66.04,40.77 S1.A1
  Bottom 0.406: U$1.D6 28.4,5.08 30.06,6.74 36.5,6.74 37.09,6.15 37.09,4.01 37.68,3.42 43.6,3.42 44.19,4.01 44.19,13.71 66.04,35.56 v66.04,39.37
SPI_CLK
  Bottom 0.406: U$12.2 48.3,43.18 46.99,43.18 44.27,40.46 44.27,40.01 43.64,39.39 43.2,39.39 43.18,39.37 U$1.D13
SPI_CS  (via drill 0.38)
  Top 0.406: v41.15,15.75 48.26,22.86 v49.28,22.86
  Bottom 0.406: U$1.D10(TX2) 38.1,12.7 v41.15,15.75 | v49.28,22.86 50.8,24.38 50.8,30.48 49.39,31.89 49.39,40.5 49.53,40.64 49.24,40.93 49.24,40.99 48.97,41.27 U$12.5
SPI_MISO
  Bottom 0.406: U$1.D12 43.18,13.97 45.09,15.88 45.06,15.9 44.45,16.51 44.45,39.31 47.64,42.5 48.27,42.5 U$12.3
SPI_MOSI  (via drill 0.38)
  Top 0.406: v42.42,15.75 47.5,20.83 v48.26,20.83
  Bottom 0.406: U$1.D11 40.64,13.97 v42.42,15.75 | U$12.4 48.41,41.85 49.17,41.85 51.36,39.66 51.36,23.88 49.59,22.11 49.54,22.11 v48.26,20.83
SWITCH_1  (via drill 0.38)
  Top 0.406: R12.1 75.45,65.8 v41.15,31.5
  Bottom 0.406: U$1.A1 38.1,28.45 v41.15,31.5
SWITCH_2  (via drill 0.38)
  Top 0.406: R9.1 60.21,48.02 41.15,28.96 v37.08,28.96
  Bottom 0.406: v37.08,28.96 35.56,27.43 U$1.A2
SWITCH_3  (via drill 0.38)
  Top 0.406: v34.04,26.92 41.15,26.92 48.26,34.04 113.04,34.04 R10.1
  Bottom 0.406: v34.04,26.92 33.02,25.91 U$1.A3
SWITCH_4  (via drill 0.38)
  Top 0.406: R13.1 116.59,12.7 115.57,12.7 109.22,6.35 v67.31,6.35 | U$1.A4 37.59,13.21 v45.72,13.21
  Bottom 0.406: v45.72,13.21 52.58,6.35 v67.31,6.35
VOLT_SENSE_1
  Top 0.406: VOLTAGE1.1 27.94,66.04 28.57,65.41 U$3.3
  Bottom 0.406: R29.1 17.99,68.12 VOLTAGE1.1
VOLT_SENSE_1_AMP
  Top 0.406: U$3.2 U$3.1 34.48,63.56 R1.1
VOLT_SENSE_1_FILT
  Top 0.406: C3.1 R1.2 38.48,63.5 U$2.1
VOLT_SENSE_2
  Top 0.406: VOLTAGE2.1 21.74,58.36 U$3.5
  Bottom 0.406: R28.1 17.99,56.7 VOLTAGE2.1
VOLT_SENSE_2_AMP
  Top 0.406: U$3.6 U$3.7 29.84,60.33 30.48,60.96 32,60.96 R2.1
VOLT_SENSE_2_FILT
  Top 0.406: C4.1 R2.2 38.1,58.42 45.72,50.8 49.53,50.8 50.16,51.44 U$2.2
VOLT_SENSE_3
  Top 0.406: VOLTAGE3.1 27.94,43.18 28.57,42.55 U$4.3
  Bottom 0.406: R27.1 17.99,45.27 VOLTAGE3.1
VOLT_SENSE_3_AMP
  Top 0.406: U$4.2 U$4.1 34.48,40.7 R3.1
VOLT_SENSE_3_FILT
  Top 0.406: C5.1 R3.2 40.64,40.64 51.44,51.44 U$2.3
VOLT_SENSE_4
  Top 0.406: VOLTAGE4.1 21.74,35.5 U$4.5
  Bottom 0.406: R26.1 17.99,33.84 VOLTAGE4.1
VOLT_SENSE_4_AMP
  Top 0.406: U$4.6 U$4.7 29.84,37.47 30.48,38.1 32,38.1 R4.1
VOLT_SENSE_4_FILT
  Top 0.406: C6.1 R4.2 38.1,35.56 52.7,50.16 U$2.4

### Text on the board
tDocu: CURRENT SENSOR CH1 | CURRENT SENSOR CH2 | CURRENT SENSOR CH3 | CURRENT SENSOR CH4 | ↑Current | ↑Current | ↑Current | ↑Current | Install either current sensor or connector, not both (4x) | CONTACTOR CH1 | VOLTAGE SENSE CH1 | VOLTAGE SENSE CH2 | CONTACTOR CH2 | VOLTAGE SENSE CH3 | VOLTAGE SENSE CH4 | CONTACTOR CH3 | Battery Discharge Monitoring Board 2019 rev1 | 5V | MAIN / POWER | CONTACTOR / POWER | CONTACTOR CH4